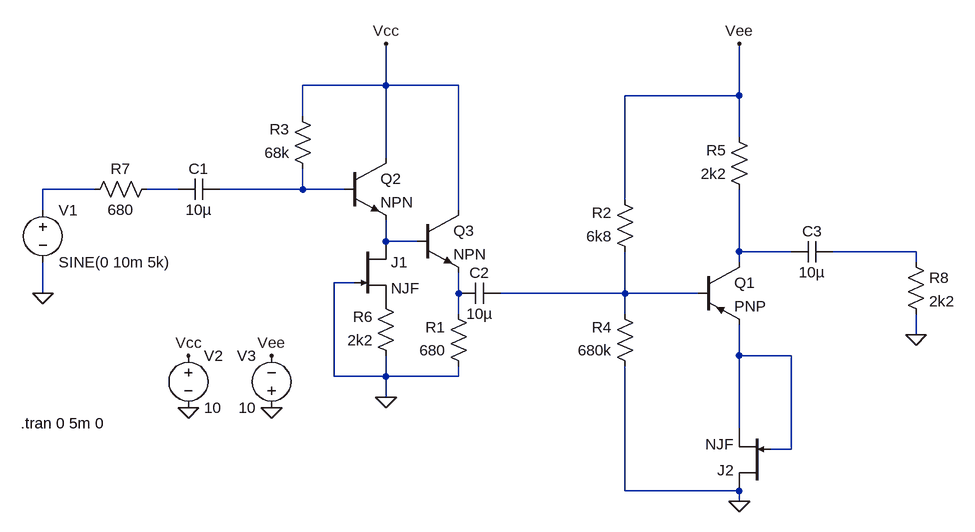
[diagram p0: schematic tp2_circ.asc]
tp2_circ.asc, the LTspice schematic file:
Version 4
SHEET 1 1184 680
WIRE -128 -272 -128 -336
WIRE -128 -272 -256 -272
WIRE -16 -272 -128 -272
WIRE 416 -256 416 -336
WIRE 416 -256 240 -256
WIRE -256 -224 -256 -272
WIRE 416 -192 416 -256
WIRE -128 -160 -128 -272
WIRE -576 -112 -656 -112
WIRE -448 -112 -496 -112
WIRE -256 -112 -256 -144
WIRE -256 -112 -384 -112
WIRE -192 -112 -256 -112
WIRE 240 -96 240 -256
WIRE -656 -80 -656 -112
WIRE -16 -80 -16 -272
WIRE -128 -32 -128 -64
WIRE -80 -32 -128 -32
WIRE 416 -16 416 -112
WIRE 496 -16 416 -16
WIRE 688 -16 560 -16
WIRE 416 0 416 -16
WIRE 688 0 688 -16
WIRE -176 32 -208 32
WIRE -656 48 -656 0
WIRE -16 48 -16 16
WIRE 240 48 240 -16
WIRE 240 48 48 48
WIRE 352 48 240 48
WIRE -16 80 -16 48
WIRE 240 80 240 48
WIRE 688 112 688 80
WIRE 416 144 416 96
WIRE 496 144 416 144
WIRE -208 176 -208 32
WIRE -128 176 -128 144
WIRE -128 176 -208 176
WIRE -16 176 -16 160
WIRE -16 176 -128 176
WIRE -128 208 -128 176
WIRE 416 256 416 144
WIRE 496 288 496 144
WIRE 496 288 464 288
WIRE 240 352 240 160
WIRE 416 352 240 352
WIRE 416 368 416 352
FLAG -128 208 0
FLAG -656 48 0
FLAG -128 -336 Vcc
FLAG -432 224 0
FLAG -432 144 Vcc
FLAG 688 112 0
FLAG -304 224 0
FLAG -304 144 Vee
FLAG 416 -336 Vee
FLAG 416 368 0
DATAFLAG 416 144 ""
DATAFLAG 416 144 ""
DATAFLAG 416 144 ""
SYMBOL res 0 176 R180
WINDOW 0 36 76 Left 2
WINDOW 3 36 40 Left 2
SYMATTR InstName R1
SYMATTR Value 680
SYMBOL res 256 0 R180
WINDOW 0 36 76 Left 2
WINDOW 3 36 40 Left 2
SYMATTR InstName R2
SYMATTR Value 6k8
SYMBOL res -240 -128 R180
WINDOW 0 36 76 Left 2
WINDOW 3 36 40 Left 2
SYMATTR InstName R3
SYMATTR Value 68k
SYMBOL res 256 176 R180
WINDOW 0 36 76 Left 2
WINDOW 3 36 40 Left 2
SYMATTR InstName R4
SYMATTR Value 680k
SYMBOL res 432 -96 R180
WINDOW 0 36 76 Left 2
WINDOW 3 36 40 Left 2
SYMATTR InstName R5
SYMATTR Value 2k2
SYMBOL res -112 160 R180
WINDOW 0 36 76 Left 2
WINDOW 3 36 40 Left 2
SYMATTR InstName R6
SYMATTR Value 2k2
SYMBOL njf -176 -32 R0
SYMATTR InstName J1
SYMBOL njf 464 352 R180
SYMATTR InstName J2
SYMBOL pnp 352 0 R0
SYMATTR InstName Q1
SYMBOL npn -192 -160 R0
SYMATTR InstName Q2
SYMBOL npn -80 -80 R0
SYMATTR InstName Q3
SYMBOL cap -384 -128 R90
WINDOW 0 0 32 VBottom 2
WINDOW 3 32 32 VTop 2
SYMATTR InstName C1
SYMATTR Value 10µ
SYMBOL res -480 -128 R90
WINDOW 0 0 56 VBottom 2
WINDOW 3 32 56 VTop 2
SYMATTR InstName R7
SYMATTR Value 680
SYMBOL voltage -656 -96 R0
WINDOW 123 0 0 Left 2
WINDOW 39 0 0 Left 2
SYMATTR InstName V1
SYMATTR Value SINE(0 10m 5k)
SYMBOL cap 48 32 R90
WINDOW 0 0 32 VBottom 2
WINDOW 3 32 32 VTop 2
SYMATTR InstName C2
SYMATTR Value 10µ
SYMBOL voltage -432 128 R0
WINDOW 123 0 0 Left 2
WINDOW 39 0 0 Left 2
SYMATTR InstName V2
SYMATTR Value 10
SYMBOL cap 496 0 R270
WINDOW 0 32 32 VTop 2
WINDOW 3 0 32 VBottom 2
SYMATTR InstName C3
SYMATTR Value 10µ
SYMBOL res 672 -16 R0
SYMATTR InstName R8
SYMATTR Value 2k2
SYMBOL voltage -304 240 R180
WINDOW 0 24 96 Left 2
WINDOW 3 24 16 Left 2
WINDOW 123 0 0 Left 2
WINDOW 39 0 0 Left 2
SYMATTR InstName V3
SYMATTR Value 10
TEXT -690 248 Left 2 !.tran 0 5m 0

The netlist it stands for:
* tp2_circ.asc
R1 0 N007 680
R2 N008 Vee 6k8
R3 N003 Vcc 68k
R4 0 N008 680k
R5 N005 Vee 2k2
R6 0 P001 2k2
J1 N004 0 P001 NJF
J2 0 N009 N009 NJF
Q1 N005 N008 N009 0 PNP
Q2 Vcc N003 N004 0 NPN
Q3 Vcc N004 N007 0 NPN
C1 N003 N002 10µ
R7 N002 N001 680
V1 N001 0 SINE(0 10m 5k)
C2 N008 N007 10µ
V2 Vcc 0 10
C3 N005 N006 10µ
R8 N006 0 2k2
V3 0 Vee 10
.model NPN NPN
.model PNP PNP
.lib standard.bjt
.model NJF NJF
.model PJF PJF
.lib standard.jft
.tran 0 5m 0
.backanno
.end